# EAGLE design 主機Microduino v0.5 (EAGLE 6.3)
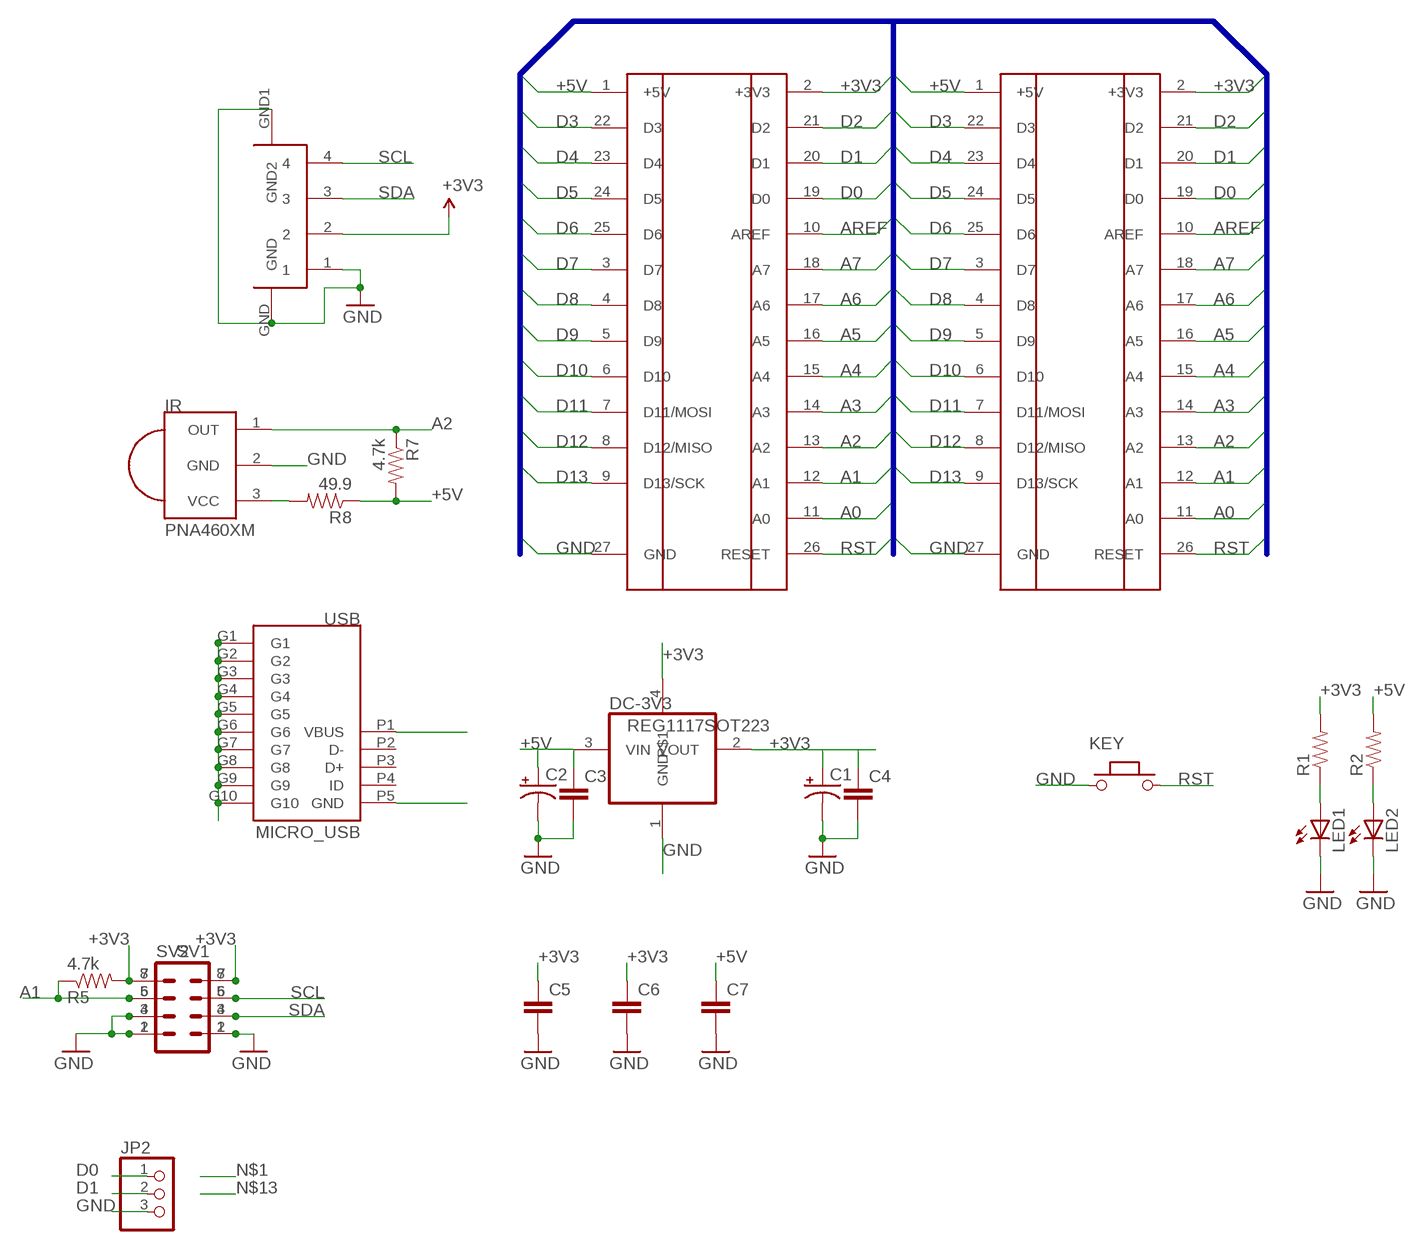
[diagram p0: schematic, sheet 1]

## Parts
C1  CAP_POL3528  [EIA3528]
C2  CAP_POL3528  [EIA3528]
C3  CAP0603-CAP  [0603-CAP]
C4  CAP0603-CAP  [0603-CAP]
C5  CAP0603-CAP  [0603-CAP]
C6  CAP0603-CAP  [0603-CAP]
C7  CAP0603-CAP  [0603-CAP]
DC-3V3  REG1117SOT223  [SOT223]
IR  PNA460XM  [PNA460XM]
JP2  PINHD-1X3  [1X03]
KEY  KEY-TES-018  [KEY-TS-018]
LED1  LED0805  [0805-LED]
LED2  LED0805  [0805-LED]
R1  RESISTOR0603-RES  [0603-RES]
R2  RESISTOR0603-RES  [0603-RES]
R5  4.7k  RESISTOR0603-RES  [0603-RES]
R7  4.7k  RESISTOR0603-RES  [0603-RES]
R8  49.9  RESISTOR0603-RES  [0603-RES]
SV1  MA04-2  [MA04-2]
SV2  MA04-2  [MA04-2]
U$1  PING-MICRDUINO/1009  [PIN-MICRODUINO-1009]
U$2  PING-MICRDUINO/1009  [PIN-MICRODUINO-1009]
U$3  S4B-XH-SM4-TB  [XH-SM4-TB]
USB  MICRO_USB  [MICRO_USB_LJ]

## Nets
+3V3: C1.A(+) C4.1 C5.1 C6.1 DC-3V3.2(VOUT) DC-3V3.4 R1.2 R5.2 SV1.7 SV1.8 SV2.7 SV2.8 U$1.2(+3V3) U$2.2(+3V3) U$3.2
+5V: C2.A(+) C3.1 C7.1 DC-3V3.3(VIN) R2.2 R7.2 R8.1 U$1.1(+5V) U$2.1(+5V) USB.P1(VBUS)
A0: U$1.11(A0) U$2.11(A0)
A1: R5.1 SV1.5 SV2.6 U$1.12(A1) U$2.12(A1)
A2: IR.1(OUT) R7.1 U$1.13(A2) U$2.13(A2)
A3: U$1.14(A3) U$2.14(A3)
A4: U$1.15(A4) U$2.15(A4)
A5: U$1.16(A5) U$2.16(A5)
A6: U$1.17(A6) U$2.17(A6)
A7: U$1.18(A7) U$2.18(A7)
AREF: U$1.10(AREF) U$2.10(AREF)
D0: JP2.1 U$1.19(D0) U$2.19(D0)
D1: JP2.2 U$1.20(D1) U$2.20(D1)
D2: U$1.21(D2) U$2.21(D2)
D3: U$1.22(D3) U$2.22(D3)
D4: U$1.23(D4) U$2.23(D4)
D5: U$1.24(D5) U$2.24(D5)
D6: U$1.25(D6) U$2.25(D6)
D7: U$1.3(D7) U$2.3(D7)
D8: U$1.4(D8) U$2.4(D8)
D9: U$1.5(D9) U$2.5(D9)
D10: U$1.6(D10) U$2.6(D10)
D11: U$1.7(D11/MOSI) U$2.7(D11/MOSI)
D12: U$1.8(D12/MISO) U$2.8(D12/MISO)
D13: U$1.9(D13/SCK) U$2.9(D13/SCK)
GND: C1.C(-) C2.C(-) C3.2 C4.2 C5.2 C6.2 C7.2 DC-3V3.1(GND) IR.2(GND) JP2.3 KEY.2 LED1.C LED2.C SV1.1 SV1.2 SV1.3 SV2.1 SV2.2 SV2.4 U$1.27(GND) U$2.27(GND) U$3.1 U$3.GND U$3.GND1(GND2) USB.G1 USB.G2 USB.G3 USB.G4 USB.G5 USB.G6 USB.G7 USB.G8 USB.G9 USB.G10 USB.P5(GND)
N$2: IR.3(VCC) R8.2
N$7: LED1.A R1.1
N$11: LED2.A R2.1
RST: KEY.1 U$1.26(RESET) U$2.26(RESET)
SCL: SV1.6 SV2.5 U$3.4
SDA: SV1.4 SV2.3 U$3.3
Unconnected: USB.P2(D-) USB.P3(D+) USB.P4(ID)

## Buses
B$1

## Library data of the parts
C1 C2 = microduino:CAP_POL: Capacitor Polarized These are standard SMD and PTH capacitors. Normally 10uF, 47uF, and 100uF in electrolytic and tantalum varieties. Always verify the external diameter of the through hole cap, it varies with capacity, voltage, and manufacturer. The EIA devices should be standard.
C3-C7 = microduino:CAP: Capacitor Standard 0603 ceramic capacitor, and 0.1" leaded capacitor.
DC-3V3 = 00my:REG1117
IR = adafruit:PNA460XM: IR 38KHz receiver PNA4602 and related receivers http://www.ladyada.net/library/pcb/eaglelibrary.html
JP2 = pinhead:PINHD-1X3: PIN HEADER
KEY = 00my:KEY
LED1 LED2 = 00my:LED: LEDs Standard schematic elements and footprints for 5mm, 3mm, 1206, and 0603 sized LEDs. 5mm - Spark Fun Electronics SKU : COM-00529 (and others)
R1 R2 = 00my:RESISTOR: Resistor Basic schematic elements and footprints for 0603, 1206, and PTH 1/10th watt (small) resistors.
R5 R7 R8 = MY:RESISTOR: Resistor Basic schematic elements and footprints for 0603, 1206, and PTH 1/10th watt (small) resistors.
SV1 SV2 = pkj:MA04-2: PIN HEADER; OC_FARNELL: unknown; OC_NEWARK: unknown
U$1 U$2 = 00my:PING-MICRDUINO: microduino接腳封裝
U$3 = microduino:S4B-XH
USB = microduino:MICRO_USB

## Net classes
1 power: width 0.381 mm

## Board
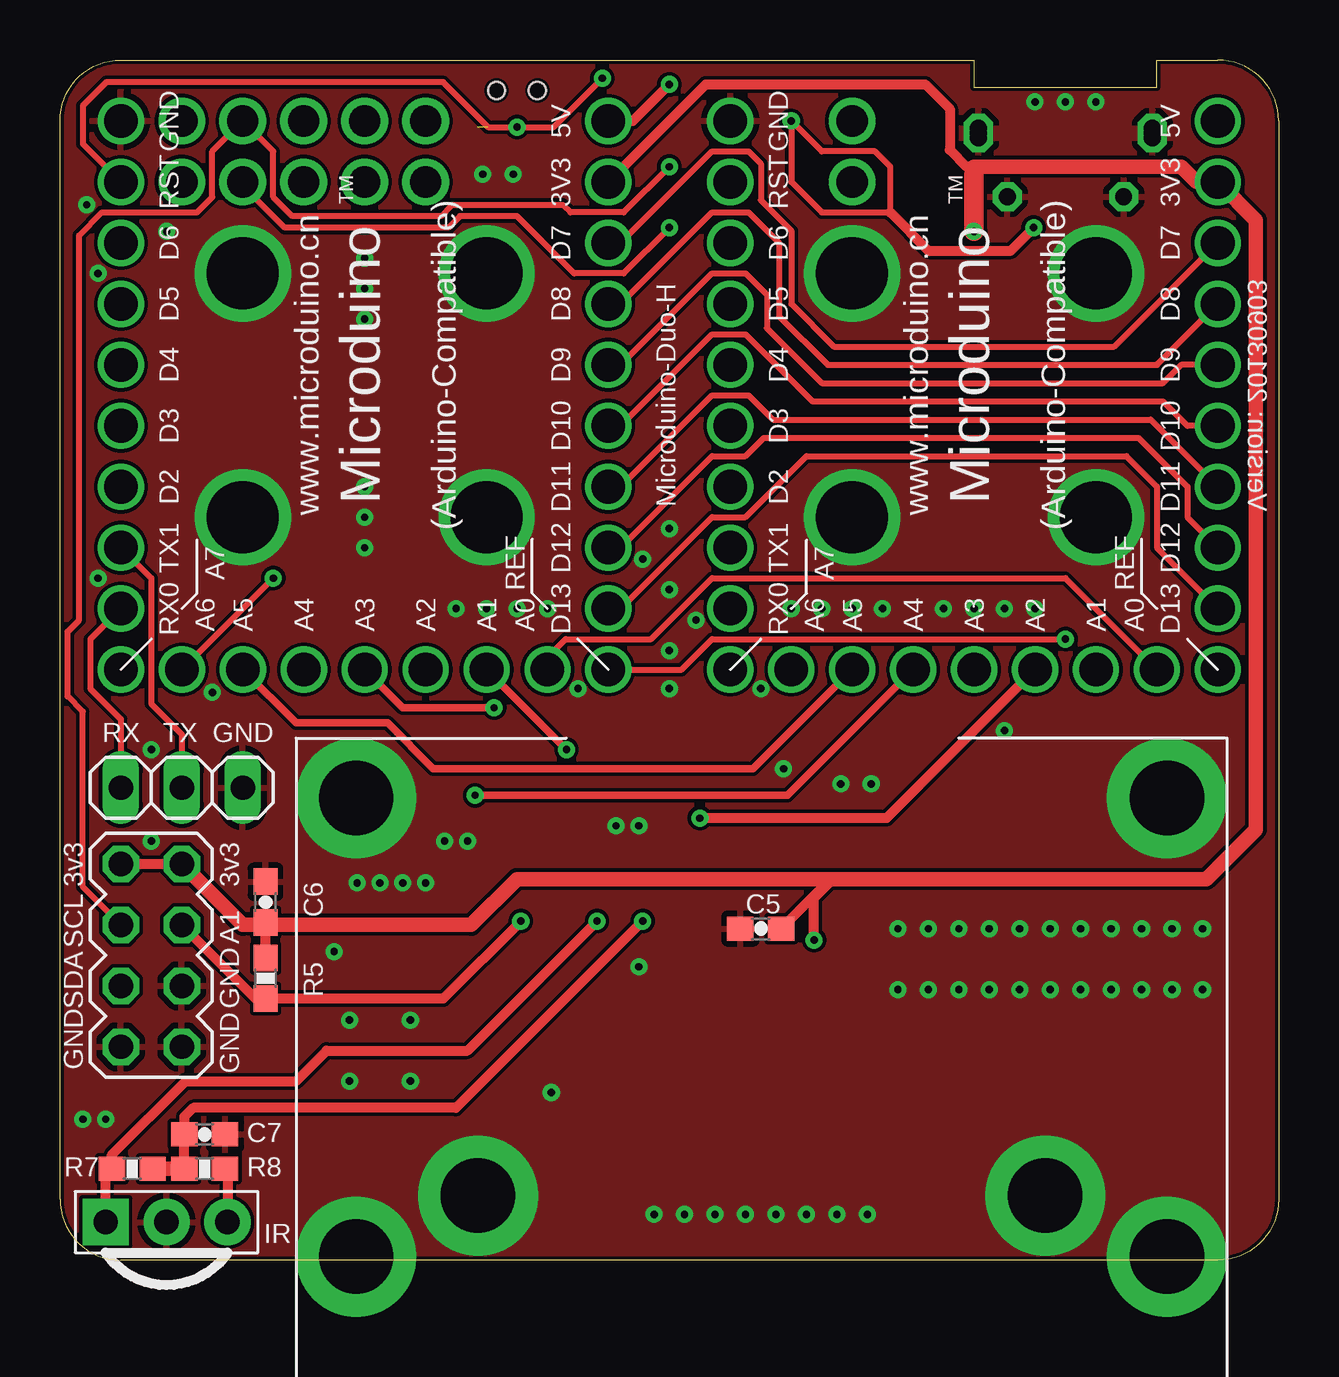
[diagram p1: board, top side]
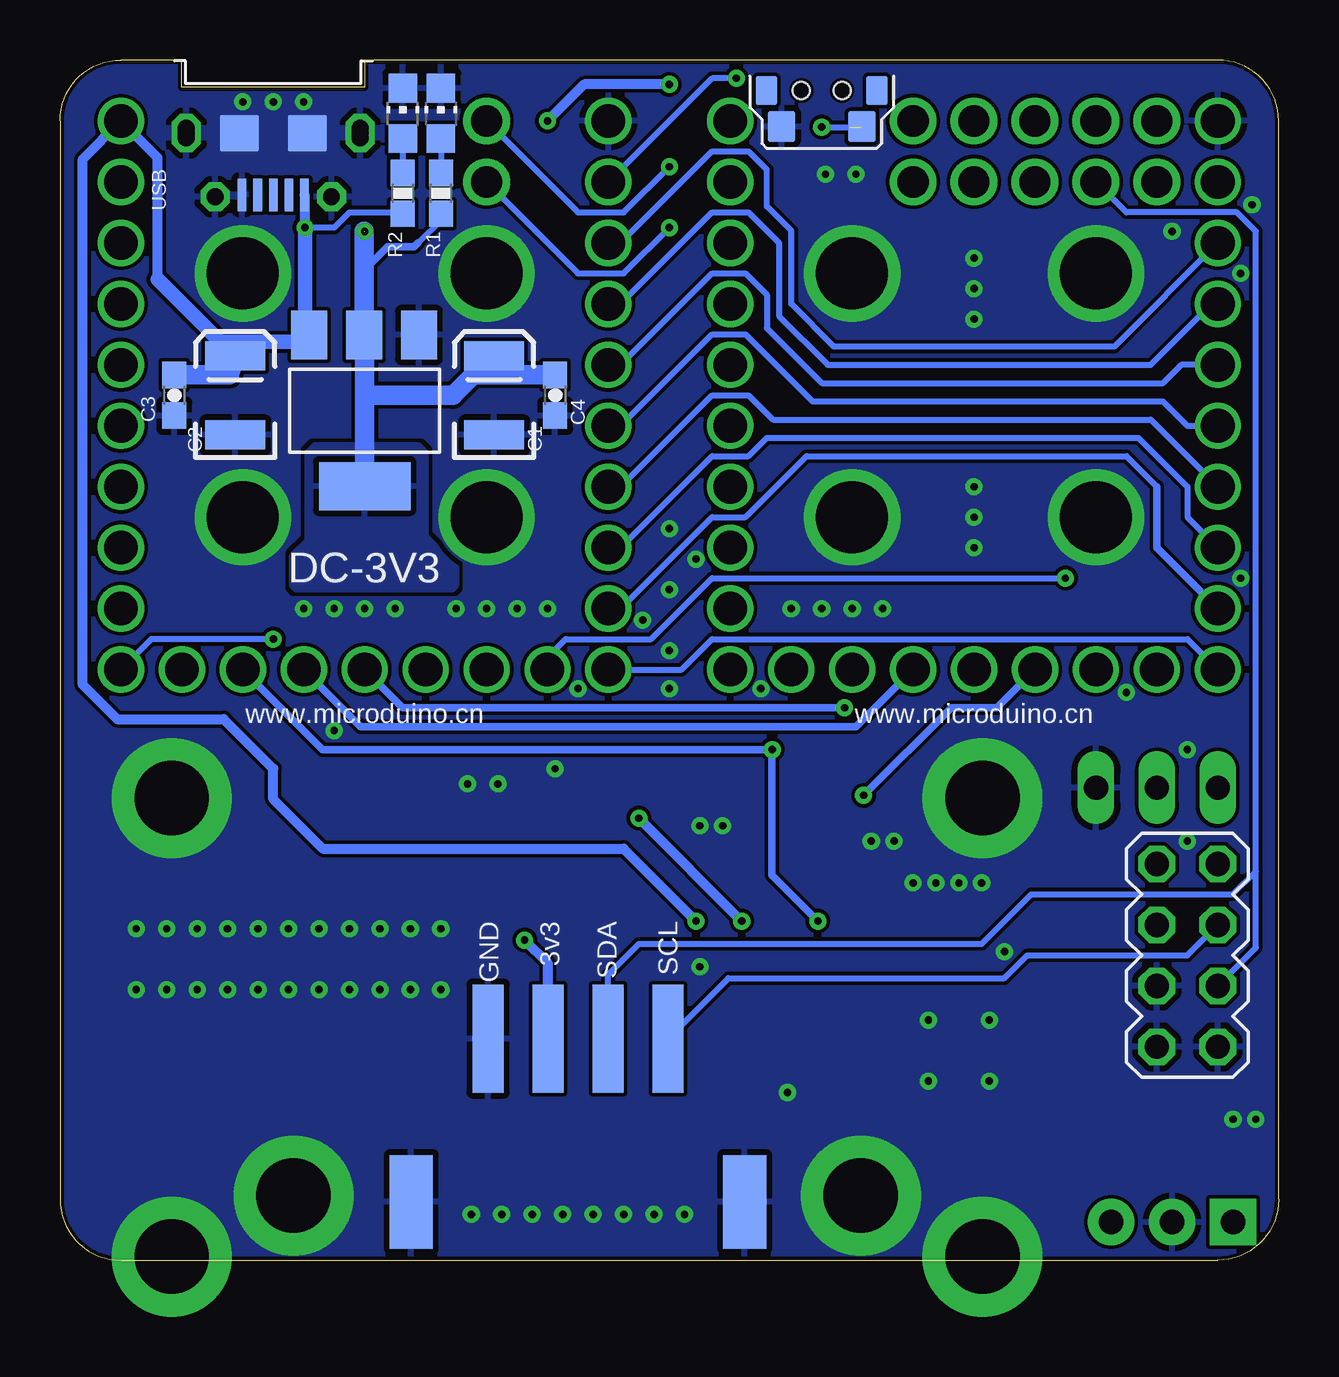
[diagram p2: board, bottom side, seen from below]

Size 50.8 x 50.01 mm. Coordinates in mm from the lower left corner, seen from the top.
Outline: 0,2.54 0,47.47 arc-90 2.54,50.01 38.1,50.01 38.1,48.86 45.72,48.86 45.72,50.01 48.26,50.01 arc-90 50.8,47.47 50.8,2.54 arc-90 48.26,0 2.54,0 arc-90 0,2.54
Copper layers (1*16): Top 0.035mm / dielectric 1.5mm / Bottom 0.035mm
Design rules "default *": minimum track width 6mil, minimum drill 12mil, track to track 6mil, track to pad 6mil, pad to pad 6mil, via to via 6mil, smd to smd 6mil, copper to edge 6mil, drill to drill 6mil, minimum pad ring 10mil, minimum via ring 8mil, stop-mask expansion 4mil, vias tented up to drill 0mil, thermal gap 10mil

### Footprints (pad centres in the part's own frame; a part is rotated, then mirrored left to right if it is on the bottom)
EIA3528 = smd 1.2 x 2.5: A 1.65,0; C -1.65,0
0603-CAP = smd 1.1 x 1: 1 -0.85,0; 2 0.85,0
SOT223 = smd 1.499 x 2.007: 1 -2.261,-3.15; 2 0.025,-3.15; 3 2.311,-3.15 | smd 3.81 x 2.007: 4 0,3.15
PNA460XM = drill 1.016 pad 1.93 square: 1 -2.54,0 | drill 1.016 pad 1.93: 2 0,0; 3 2.54,0
1X03 = drill 1.016 long: 1 -2.54,0; 2 0,0; 3 2.54,0
KEY-TS-018 = smd 1.15 x 1.3: 1 1.675,-1.505; 2 -1.675,-1.505 | smd 0.9 x 1.2: 3 -2.3,0; 4 2.3,0 | hole 0.7: -0.85,0; 0.85,0
0805-LED = smd 1.2 x 1.2: A 0,-1.05; C 0,1.05
0603-RES = smd 1.1 x 1: 1 -0.85,0; 2 0.85,0
MA04-2 = drill 1.016 octagon: 1 -3.81,-1.27; 2 -3.81,1.27; 3 -1.27,-1.27; 4 -1.27,1.27; 5 1.27,-1.27; 6 1.27,1.27; 7 3.81,-1.27; 8 3.81,1.27
PIN-MICRODUINO-1009 = drill 1.4 pad 1.93: 1 0,-10.16; 2 2.54,-10.16; 3 5.08,-10.16; 4 7.62,-10.16; 5 10.16,-10.16; 6 12.7,-10.16; 7 15.24,-10.16; 8 17.78,-10.16; 9 20.32,-10.16; 10 22.86,-10.16; 11 22.86,-7.62; 12 22.86,-5.08; 13 22.86,-2.54; 14 22.86,0; 15 22.86,2.54; 16 22.86,5.08; 17 22.86,7.62; 18 22.86,10.16; 19 20.32,10.16; 20 17.78,10.16; 21 15.24,10.16; 22 12.7,10.16; 23 10.16,10.16; 24 7.62,10.16; 25 5.08,10.16; 26 2.54,10.16; 27 0,10.16
XH-SM4-TB = smd 1.3 x 4.5: 1 -3.75,8.75; 2 -1.25,8.75; 3 1.25,8.75; 4 3.75,8.75 | smd 1.8 x 3.9: GND -6.95,1.95; GND1 6.95,1.95
MICRO_USB_LJ = drill 0.7 octagon: G1 -3.625,0.2; G2 -3.625,0; G3 -3.625,-0.2; G4 3.625,0.2; G5 3.625,0; G6 3.625,-0.2; G7 -2.425,2.65; G8 2.425,2.65 | smd 1.626 x 1.524: G9 -1.416,0; G10 1.416,0 | smd 0.4 x 1.35: P1 -1.3,2.575; P2 -0.65,2.575; P3 0,2.575; P4 0.65,2.575; P5 1.3,2.575

### Placement (x,y rotation side)
C1  32.7,36.04 90 bottom
C2  43.5,36.04 90 bottom
C3  46.04,36.04 270 bottom
C4  30.16,36.04 270 bottom
C5  29.21,13.81 180 top
C6  8.57,14.92 90 top
C7  6.03,5.24 0 top
DC-3V3  38.1,35.4 180 bottom
IR  4.44,1.59 0 top
JP2  5.08,19.68 0 top
KEY  19.05,48.74 0 bottom
LED1  34.92,47.78 0 bottom
LED2  36.51,47.78 0 bottom
R1  34.92,44.45 270 bottom
R2  36.51,44.45 270 bottom
R5  8.57,11.75 90 top
R7  3.02,3.81 0 top
R8  6.03,3.81 0 top
SV1  3.81,12.7 90 top
SV2  3.81,12.7 90 bottom
U$1  38.1,47.47 270 bottom
U$2  12.7,47.47 270 bottom
U$3  29.21,0.48 0 bottom
USB  41.91,46.96 180 bottom

### Tracks (layer width: path | path; a pad name or v marks a point on that pad's centre or on a via)
+3V3  (via drill 0.3)  (1 unrouted)
  Top 0.406: U$2.2 26.92,48.99 36.07,48.99 37.08,47.97 37.08,46.26 37.78,45.56 38.1,45.56 | SV1.8 SV1.7 | R5.2 C6.1 8.26,14.07 8.26,13.97 | C5.1 32.12,15.88 32.23,15.88 31.43,15.08 v31.43,13.34
  Top 0.61: 38.1,45.24 38.1,45.56 46.74,45.56 47.37,44.93 U$1.2 49.85,43.34 49.85,17.94 47.78,15.88 32.23,15.88 19.05,15.88 17.14,13.97 8.26,13.97 7.62,13.97 SV1.7
  Top 0.813: v38.1,42.86 38.1,45.24
  Bottom 0.254: R1.2 34.92,43.34 35.88,42.39
  Bottom 0.305: 35.88,42.39 36.04,42.23 37.15,42.23 37.94,41.43 38.12,41.43
  Bottom 0.406: DC-3V3.2 38.1,38.55 | U$3.2 30.46,12.36 v31.43,13.34
  Bottom 0.813: DC-3V3.2 38.12,41.43 38.12,42.86 | 38.1,38.55 38.1,36.04 | 38.1,36.04 DC-3V3.4 | C4.1 33.57,36.89 | C1.A 33.57,36.89 | 33.57,36.89 34.42,36.04 38.1,36.04
  pour Bottom (isolate 0.305, rank 5): 40.16,33.97 35.88,33.97 35.56,33.66 35.56,30.16 34.29,28.89 34.29,28.1 34.45,27.94 40.96,27.94 41.12,28.1 41.12,29.37 40.48,30 40.48,33.66
+5V  (via drill 0.3)
  Top 0.254: v30.48,47.47 30.48,44.93 31.75,43.66 34.61,43.66 34.61,45.56 33.97,46.2 31.75,46.2 v30.48,47.47
  Top 0.406: U$2.1 23.88,47.47 v25.4,48.99 | 34.61,43.66 36.2,42.07 39.64,42.07 v40.59,43.02 | R8.1 C7.1 5.18,5.98 5.56,6.35 16.51,6.35 v24.29,14.13
  Top 0.61: R8.1 R7.2
  Bottom 0.254: v40.59,43.02 39.37,43.02 38.73,43.66 37.05,43.66 R2.2
  Bottom 0.406: 46.74,40.86 46.74,45.94 U$1.1 49.85,45.88 49.85,23.97 48.42,22.54 43.97,22.54 41.91,20.48 41.91,19.21 39.85,17.15 27.3,17.15 v24.29,14.13 | 40.59,38.73 DC-3V3.3 | v25.4,48.99 28.96,48.99 v30.48,47.47 | v40.59,43.02 40.59,44.36 USB.P1
  Bottom 0.61: 44.13,38.26 46.74,40.86 | v40.59,43.02 40.59,38.73 | 44.13,38.26 40.7,38.26 DC-3V3.3 | 44.13,38.26 43.31,37.44 C2.A
  Bottom 0.813: C3.1 43.73,36.89 C2.A
A0
  Top 0.254: U$2.11 20.32,25.11 21.08,25.88 24.64,25.88 27.18,28.42 41.91,28.42 U$1.11
A1  (via drill 0.3)
  Top 0.305: v21.11,21.27 U$2.12
  Top 0.406: SV1.5 8.15,10.9 R5.1 15.98,10.9 v19.21,14.13
  Bottom 0.305: U$1.12 39.85,21.27 v21.11,21.27 21.11,16.03 v19.21,14.13
A2  (via drill 0.3)
  Top 0.406: U$1.13 34.45,18.42 v26.67,18.42 | IR.1 1.91,4.03 R7.1 2.17,4.39 5.24,7.46 9.84,7.46 11.11,8.73 16.99,8.73 v22.38,14.13
  Bottom 0.305: U$2.13 17.62,22.23 38.26,22.23 U$1.13
  Bottom 0.406: v26.67,18.42 v22.38,14.13
A3  (via drill 0.3)
  Top 0.305: v18.1,23.02 14.29,23.02 U$2.14
  Bottom 0.305: U$1.14 36.51,23.02 v18.1,23.02
A4  (via drill 0.3)
  Top 0.305: U$1.15 30.32,19.37 v17.3,19.37
  Bottom 0.305: v17.3,19.37 13.65,23.02 11.75,23.02 U$2.15
A5
  Top 0.305: U$1.16 28.89,20.48 15.56,20.48 13.65,22.38 9.84,22.38 U$2.16
A6  (via drill 0.3)
  Top 0.254: v8.89,28.42 U$2.17
  Bottom 0.254: U$1.17 30.48,25.11 29.72,25.88 26.16,25.88 23.62,28.42 v8.89,28.42
A7
  Bottom 0.254: U$1.18 24.89,24.61 23.62,25.88 3.81,25.88 U$2.18
AREF  (via drill 0.3)
  Top 0.254: U$2.10 25.91,24.61 27.18,25.88 v41.91,25.88
  Bottom 0.254: v41.91,25.88 46.99,25.88 U$1.10
D0
  Top 0.254: U$2.19 1.27,25.88 1.27,23.81 2.54,22.54 JP2.1
  Bottom 0.254: U$1.19 27.43,27.15 23.62,30.96 22.22,30.96 19.68,33.5 6.35,33.5 5.08,32.23
  Bottom 0.305: U$2.19 5.08,29.69 5.08,32.23
D1
  Top 0.254: U$2.20 3.81,28.42 3.81,23.18 5.08,21.91 JP2.2
  Bottom 0.254: 27.43,29.69 23.62,33.5 22.1,33.5 21.34,34.26 5.84,34.26 3.81,32.23 3.81,30.96 U$2.20
  Bottom 0.305: U$1.20 27.43,29.69
D2
  Bottom 0.254: U$1.21 27.43,32.23 23.62,36.04 22.1,36.04 21.08,35.02 5.33,35.02 U$2.21
D3
  Bottom 0.254: U$1.22 27.43,34.77 23.62,38.58 22.22,38.58 19.43,35.78 4.83,35.78 3.81,34.77 U$2.22
D4
  Bottom 0.254: U$1.23 27.43,37.31 23.62,41.12 22.22,41.12 21.34,40.23 21.34,38.83 19.05,36.54 4.83,36.54 4.06,37.31 U$2.23
D5
  Bottom 0.254: U$1.24 27.43,39.85 23.62,43.66 22.1,43.66 20.83,42.39 20.83,39.34 18.8,37.31 5.33,37.31 2.79,39.85 U$2.24
D6
  Bottom 0.254: U$1.25 27.43,42.39 23.62,46.2 22.1,46.2 21.34,45.43 21.34,43.91 20.32,42.89 20.32,39.85 18.54,38.07 6.86,38.07 U$2.25
D7
  Top 0.254: U$2.3 23.37,42.39 27.18,46.2 28.7,46.2 29.21,45.69 29.21,44.16 30.48,42.89 30.48,39.85 32.26,38.07 43.94,38.07 U$1.3
D8
  Top 0.254: U$2.4 23.37,39.85 27.18,43.66 28.7,43.66 29.97,42.39 29.97,39.34 32,37.31 45.72,37.31 U$1.4
D9
  Top 0.254: U$2.5 23.37,37.31 27.18,41.12 28.57,41.12 29.46,40.23 29.46,38.83 31.75,36.54 45.97,36.54 46.74,37.31 U$1.5
D10
  Top 0.254: U$2.6 23.37,34.77 27.18,38.58 28.57,38.58 31.37,35.78 45.97,35.78 46.99,34.77 U$1.6
D11
  Top 0.254: U$2.7 23.37,32.23 27.18,36.04 28.7,36.04 29.72,35.02 45.47,35.02 U$1.7
D12
  Top 0.254: U$2.8 23.37,29.69 27.18,33.5 28.57,33.5 29.34,34.26 44.96,34.26 46.99,32.23 46.99,30.96 U$1.8
D13
  Top 0.254: U$2.9 23.37,27.15 27.18,30.96 28.57,30.96 31.12,33.5 44.45,33.5 45.72,32.23 45.72,29.69 U$1.9
GND  (via drill 0.3, 3, 3.1 pad 5)
  other vias: 7.62,30.96 12.7,29.69 17.78,30.96 33.02,30.96 43.18,30.96 7.62,41.12 12.7,40.48 17.78,41.12 33.02,41.12 43.18,41.12 12.7,39.21 12.7,41.75 12.7,30.96 12.7,32.23 38.1,27.15 39.37,27.15 36.83,27.15 34.29,27.15 33.02,27.15 31.75,27.15 30.48,27.15 20.32,27.15 19.05,27.15 17.78,27.15 16.51,27.15 40.64,27.15 41.91,48.26 43.18,48.26 40.64,48.26 12.34,19.25 12.34,0.15 46.14,0.15 46.14,19.25 47.62,13.81 46.35,13.81 45.09,13.81 43.81,13.81 42.55,13.81 41.27,13.81 40,13.81 38.73,13.81 37.46,13.81 36.2,13.81 34.92,13.81 33.66,1.9 32.38,1.9 31.12,1.9 29.84,1.9 28.57,1.9 27.3,1.9 26.04,1.9 24.77,1.9 25.4,27.94 24.29,29.21 25.4,30.48 26.51,26.67 25.4,25.4 25.4,23.81 41.06,2.69 17.42,2.69 47.62,11.27 46.35,11.27 45.09,11.27 43.81,11.27 42.55,11.27 41.27,11.27 40,11.27 38.73,11.27 37.46,11.27 36.2,11.27 34.92,11.27 20.48,6.98 12.38,15.72 3.81,21.27 13.34,15.72 3.81,17.46 15.24,15.72 12.07,7.46 0.95,5.87 4.44,42.86 39.37,22.07 21.59,23.81 6.35,23.65 14.29,15.72 1.11,43.97 16.03,17.46 17.62,45.24 18.89,45.24 30.16,20.48 32.54,19.84 33.81,19.84 29.21,23.81 14.61,7.46 23.18,18.1 24.13,18.1 24.13,12.22 14.61,10 12.07,10 16.99,17.46 1.91,5.87 11.43,12.86 1.59,28.42 1.59,41.12
  pour Top: 0,50.01 50.8,50.01 50.8,0 0,0
  pour Bottom (rank 6): 0,50.01 50.8,50.01 50.8,0 0,0
N$2
  Top 0.406: R8.2 6.99,4.03 IR.3
N$3  (via drill 1.3)
  other vias: 10.16,44.93
N$4  (via drill 1.3)
  other vias: 12.7,47.47
N$5  (via drill 1.3)
  other vias: 15.24,47.47
N$6  (via drill 1.3)
  other vias: 10.16,47.47
N$7
  Bottom 0.254: LED1.A R1.1
N$8  (via drill 1.3)
  other vias: 5.08,47.47
N$9  (via drill 1.3)
  other vias: 12.7,44.93
N$10  (via drill 1.3)
  other vias: 15.24,44.93
N$11
  Bottom 0.254: LED2.A R2.1
N$12  (via drill 1.3)
  other vias: 5.08,44.93
RST  (via drill 0.3)  (1 unrouted)
  Top 0.254: v22.61,49.24 20.57,47.21 17.84,47.21 15.97,49.09 1.94,49.09 0.95,48.1 0.95,46.51 U$2.26
  Bottom 0.254: U$1.26 23.62,49.24 v22.61,49.24 | v19.05,47.21 17.39,47.21 KEY.1
SCL  (via drill 0.3, 1.3)
  Top 0.254: v25.4,45.56 23.49,43.66 21.27,43.66 20.95,43.97 16.35,43.97 15.88,43.5 9.68,43.5 8.89,44.29 8.89,46.2 v7.62,47.47 6.35,46.2 6.35,44.29 5.71,43.66 1.75,43.66 0.79,42.7 0.79,26.67 0.32,26.19 0.32,23.5 0.95,22.86 0.95,15.56 SV1.6
  Bottom 0.254: v33.02,47.47 29.21,43.66 27.3,43.66 v25.4,45.56 | U$3.4 22.94,11.75 11.43,11.75 10.48,12.7 3.81,12.7 SV1.6
SDA  (via drill 0.3, 1.3)
  Top 0.254: v25.4,43.02 23.49,41.12 21.43,41.12 19.05,43.5 16.67,43.5 16.19,43.02 9.37,43.02 7.62,44.77 v7.62,44.93
  Bottom 0.254: v33.02,44.93 29.21,41.12 27.3,41.12 v25.4,43.02 | U$3.3 27.96,11.89 26.67,13.18 12.38,13.18 10.32,15.24 1.91,15.24 0.95,16.19 | SV1.4 0.95,13.02 0.95,16.19 | 0.95,16.19 0.95,42.86 1.75,43.66 6.35,43.66 v7.62,44.93

### Text on the board
tPlace: Microduino-Duo-H | Version: 20130903 | RX | TX | GND | 3v3 | 3v3 | SCL | A1 | SDA | GND | GND | GND
bPlace: SCL | SDA | 3v3 | GND